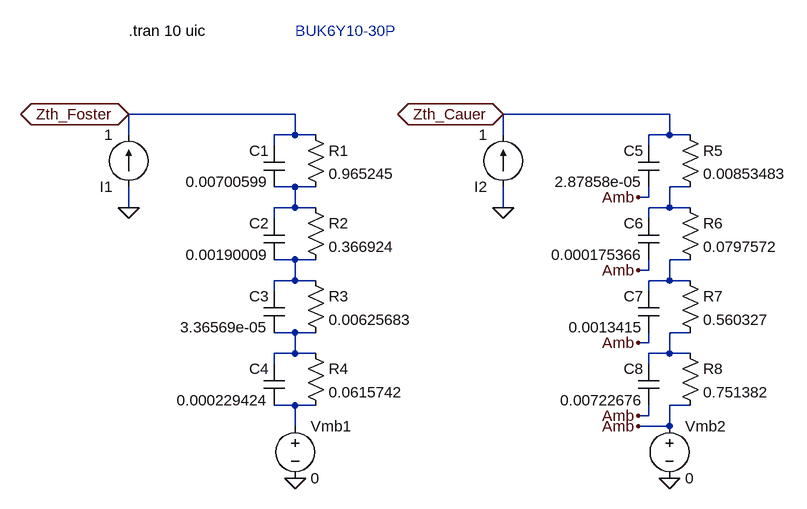
[diagram p0: schematic BUK6Y10-30P.asc]
BUK6Y10-30P.asc, the LTspice schematic file:
Version 4
SHEET 1 2048 1556
* Foster supply
WIRE -496 256 -752 256
WIRE -752 288 -752 256
WIRE -496 288 -496 256
WIRE -752 400 -752 368
SYMBOL current -752 368 R180
SYMATTR InstName I1
SYMATTR Value 1
FLAG -752 400 0
FLAG -752 256 Zth_Foster
IOPIN -752 256 BiDir

* Cauer supply
WIRE 80 256 -176 256
WIRE -176 288 -176 256
WIRE 80 288 80 256
WIRE -176 400 -176 368
SYMBOL current -176 368 R180
SYMATTR InstName I2         
SYMATTR Value 1
FLAG -176 400 0             
FLAG -176 256 Zth_Cauer
IOPIN -176 256 BiDir

* Title & SPICE directive
TEXT -752 128 Left 2 !.tran 10 uic
TEXT -496 128 Left 2 ;BUK6Y10-30P

* Foster RC chain 1
WIRE -496 288 -528 288
WIRE -528 304 -528 288
WIRE -496 368 -528 368
WIRE -464 288 -496 288
WIRE -464 368 -496 368
WIRE -496 400 -496 368
SYMBOL res -480 272 R0
SYMATTR InstName R1
SYMATTR Value 0.965245
SYMBOL cap -512 304 M0
SYMATTR InstName C1
SYMATTR Value 0.00700599

* Foster RC chain 2
WIRE -496 400 -528 400
WIRE -528 416 -528 400
WIRE -496 480 -528 480
WIRE -464 400 -496 400
WIRE -464 480 -496 480
WIRE -496 512 -496 480
SYMBOL res -480 384 R0
SYMATTR InstName R2
SYMATTR Value 0.366924
SYMBOL cap -512 416 M0
SYMATTR InstName C2
SYMATTR Value 0.00190009

* Foster RC chain 3
WIRE -496 512 -528 512
WIRE -528 528 -528 512
WIRE -496 592 -528 592
WIRE -464 512 -496 512
WIRE -464 592 -496 592
WIRE -496 624 -496 592
SYMBOL res -480 496 R0
SYMATTR InstName R3
SYMATTR Value 0.00625683
SYMBOL cap -512 528 M0
SYMATTR InstName C3
SYMATTR Value 3.36569e-05

* Foster RC chain 4
WIRE -496 624 -528 624
WIRE -528 640 -528 624
WIRE -496 704 -528 704
WIRE -464 624 -496 624
WIRE -464 704 -496 704
WIRE -496 736 -496 704
SYMBOL res -480 608 R0
SYMATTR InstName R4
SYMATTR Value 0.0615742
SYMBOL cap -512 640 M0
SYMATTR InstName C4
SYMATTR Value 0.000229424
SYMBOL voltage -496 720 R0
SYMATTR InstName Vmb1
SYMATTR Value 0
FLAG -496 816 0

* Cauer RC chain 1
WIRE 48 288 80 288
WIRE 48 304 48 288
WIRE 48 368 48 384
WIRE 48 384 32 384
WIRE 80 288 112 288
WIRE 80 368 112 368
WIRE 80 400 80 368
SYMBOL res 96 272 R0
SYMATTR InstName R5
SYMATTR Value 0.00853483
SYMBOL cap 64 304 M0
SYMATTR InstName C5
SYMATTR Value 2.87858e-05
FLAG 32 384 Amb

* Cauer RC chain 2
WIRE 48 400 80 400
WIRE 48 416 48 400
WIRE 48 480 48 496
WIRE 48 496 32 496
WIRE 80 400 112 400
WIRE 80 480 112 480
WIRE 80 512 80 480
SYMBOL res 96 384 R0
SYMATTR InstName R6
SYMATTR Value 0.0797572
SYMBOL cap 64 416 M0
SYMATTR InstName C6
SYMATTR Value 0.000175366
FLAG 32 496 Amb

* Cauer RC chain 3
WIRE 48 512 80 512
WIRE 48 528 48 512
WIRE 48 592 48 608
WIRE 48 608 32 608
WIRE 80 512 112 512
WIRE 80 592 112 592
WIRE 80 624 80 592
SYMBOL res 96 496 R0
SYMATTR InstName R7
SYMATTR Value 0.560327
SYMBOL cap 64 528 M0
SYMATTR InstName C7
SYMATTR Value 0.0013415
FLAG 32 608 Amb

* Cauer RC chain 4
WIRE 48 624 80 624
WIRE 48 640 48 624
WIRE 48 704 48 720
WIRE 48 720 32 720
WIRE 80 624 112 624
WIRE 80 704 112 704
WIRE 80 736 80 704
SYMBOL res 96 608 R0
SYMATTR InstName R8
SYMATTR Value 0.751382
SYMBOL cap 64 640 M0
SYMATTR InstName C8
SYMATTR Value 0.00722676
FLAG 32 720 Amb
WIRE 80 736 32 736
FLAG 32 736 Amb
SYMBOL voltage 80 720 R0
SYMATTR InstName Vmb2
SYMATTR Value 0
FLAG 80 816 0

The netlist it stands for:
* BUK6Y10-30P.asc
I1 0 Zth_Foster 1
I2 0 Zth_Cauer 1
R1 Zth_Foster N001 0.965245
C1 Zth_Foster N001 0.00700599
R2 N001 N002 0.366924
C2 N001 N002 0.00190009
R3 N002 N003 0.00625683
C3 N002 N003 3.36569e-05
R4 N003 N004 0.0615742
C4 N003 N004 0.000229424
Vmb1 N004 0 0
R5 Zth_Cauer N005 0.00853483
C5 Zth_Cauer Amb 2.87858e-05
R6 N005 N006 0.0797572
C6 N005 Amb 0.000175366
R7 N006 N007 0.560327
C7 N006 Amb 0.0013415
R8 N007 Amb 0.751382
C8 N007 Amb 0.00722676
Vmb2 Amb 0 0
.tran 10 uic
* BUK6Y10-30P
.backanno
.end